# EAGLE schematic DP_eDP_Adapter (EAGLE 6.4)

## Sheet 1 of 3
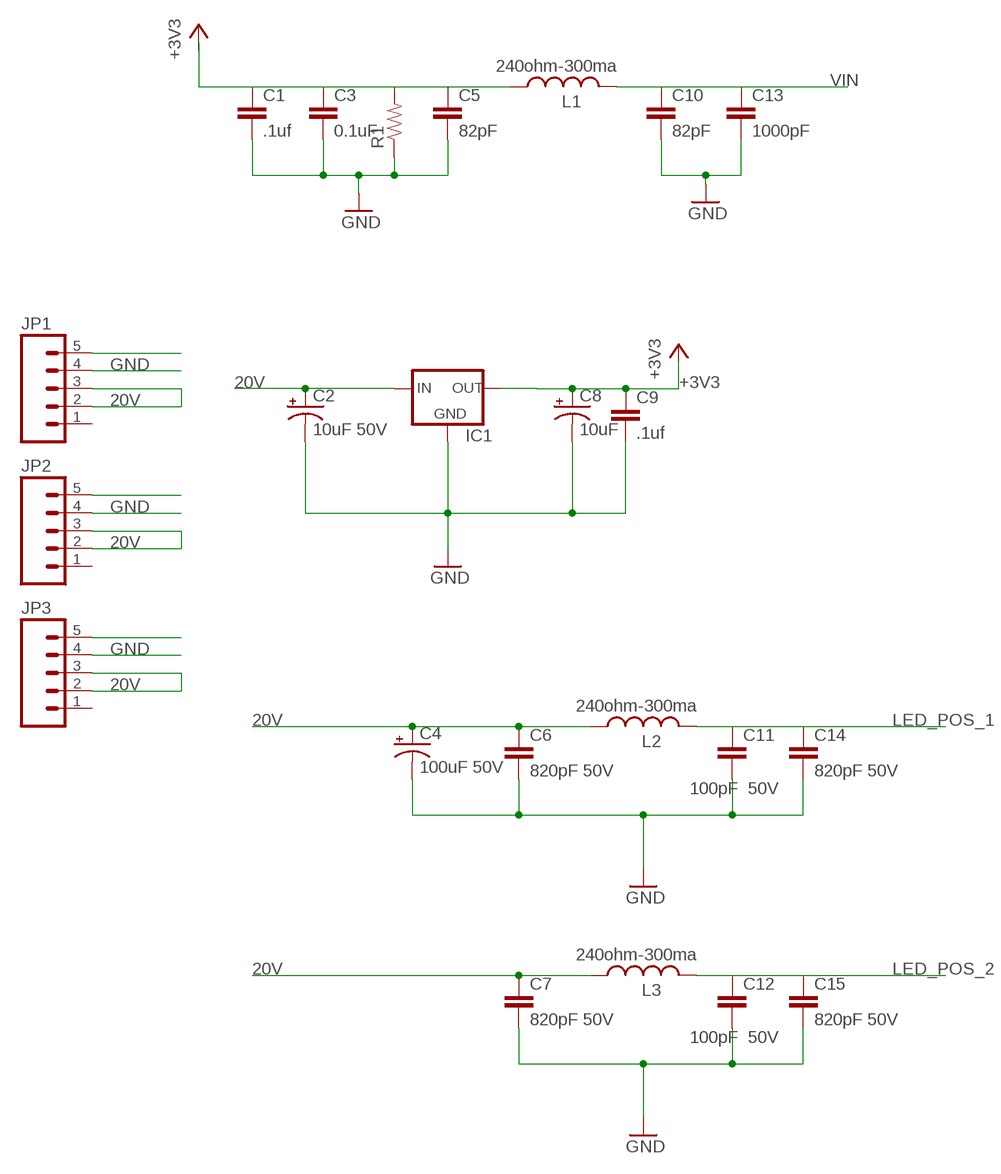
[diagram p0: schematic, sheet 1]

### Parts
C1  .1uf  CAP0402-CAP  [0402-CAP]
C2  10uF 50V  CAP_POL6032  [EIA6032]
C3  0.1uF  CAP0402-CAP  [0402-CAP]
C4  100uF 50V  CAP_POL6032  [EIA6032]
C5  82pF  CAP0402-CAP  [0402-CAP]
C6  820pF 50V  CAP0402-CAP  [0402-CAP]
C7  820pF 50V  CAP0402-CAP  [0402-CAP]
C8  10uF  CAP_POL6032  [EIA6032]
C9  .1uf  CAP0402-CAP  [0402-CAP]
C10  82pF  CAP0402-CAP  [0402-CAP]
C11  100pF 50V  CAP0402-CAP  [0402-CAP]
C12  100pF 50V  CAP0402-CAP  [0402-CAP]
C13  1000pF  CAP0402-CAP  [0402-CAP]
C14  820pF 50V  CAP0402-CAP  [0402-CAP]
C15  820pF 50V  CAP0402-CAP  [0402-CAP]
IC1  78XXS  [78XXS]
JP1  M05PTH  [1X05]
JP2  M05PTH  [1X05]
JP3  M05PTH  [1X05]
L1  240ohm-300ma  L-US  [R0402]
L2  240ohm-300ma  L-US  [R0402]
L3  240ohm-300ma  L-US  [R0402]
R1  RESISTOR0402-RES  [0402-RES]

### Nets
20V [Power]: C2.P$1(+) C4.P$1(+) C6.1 C7.1 IC1.IN JP1.2 JP1.3 JP2.2 JP2.3 JP3.2 JP3.3 L2.1 L3.1
+3V3: C1.1 C3.1 C5.1 C8.P$1(+) C9.1 IC1.OUT L1.1 R1.2 ; also sheet 2,3
GND: C1.2 C2.P$2(-) C3.2 C4.P$2(-) C5.2 C6.2 C7.2 C8.P$2(-) C9.2 C10.2 C11.2 C12.2 C13.2 C14.2 C15.2 IC1.GND JP1.4 JP1.5 JP2.4 JP2.5 JP3.4 JP3.5 R1.1 ; also sheet 2,3
LED_POS_1: C11.1 C14.1 L2.2 ; also sheet 3
LED_POS_2: C12.1 C15.1 L3.2 ; also sheet 3
VIN: C10.1 C13.1 L1.2 ; also sheet 3
Unconnected: JP1.1 JP2.1 JP3.1

## Sheet 2 of 3
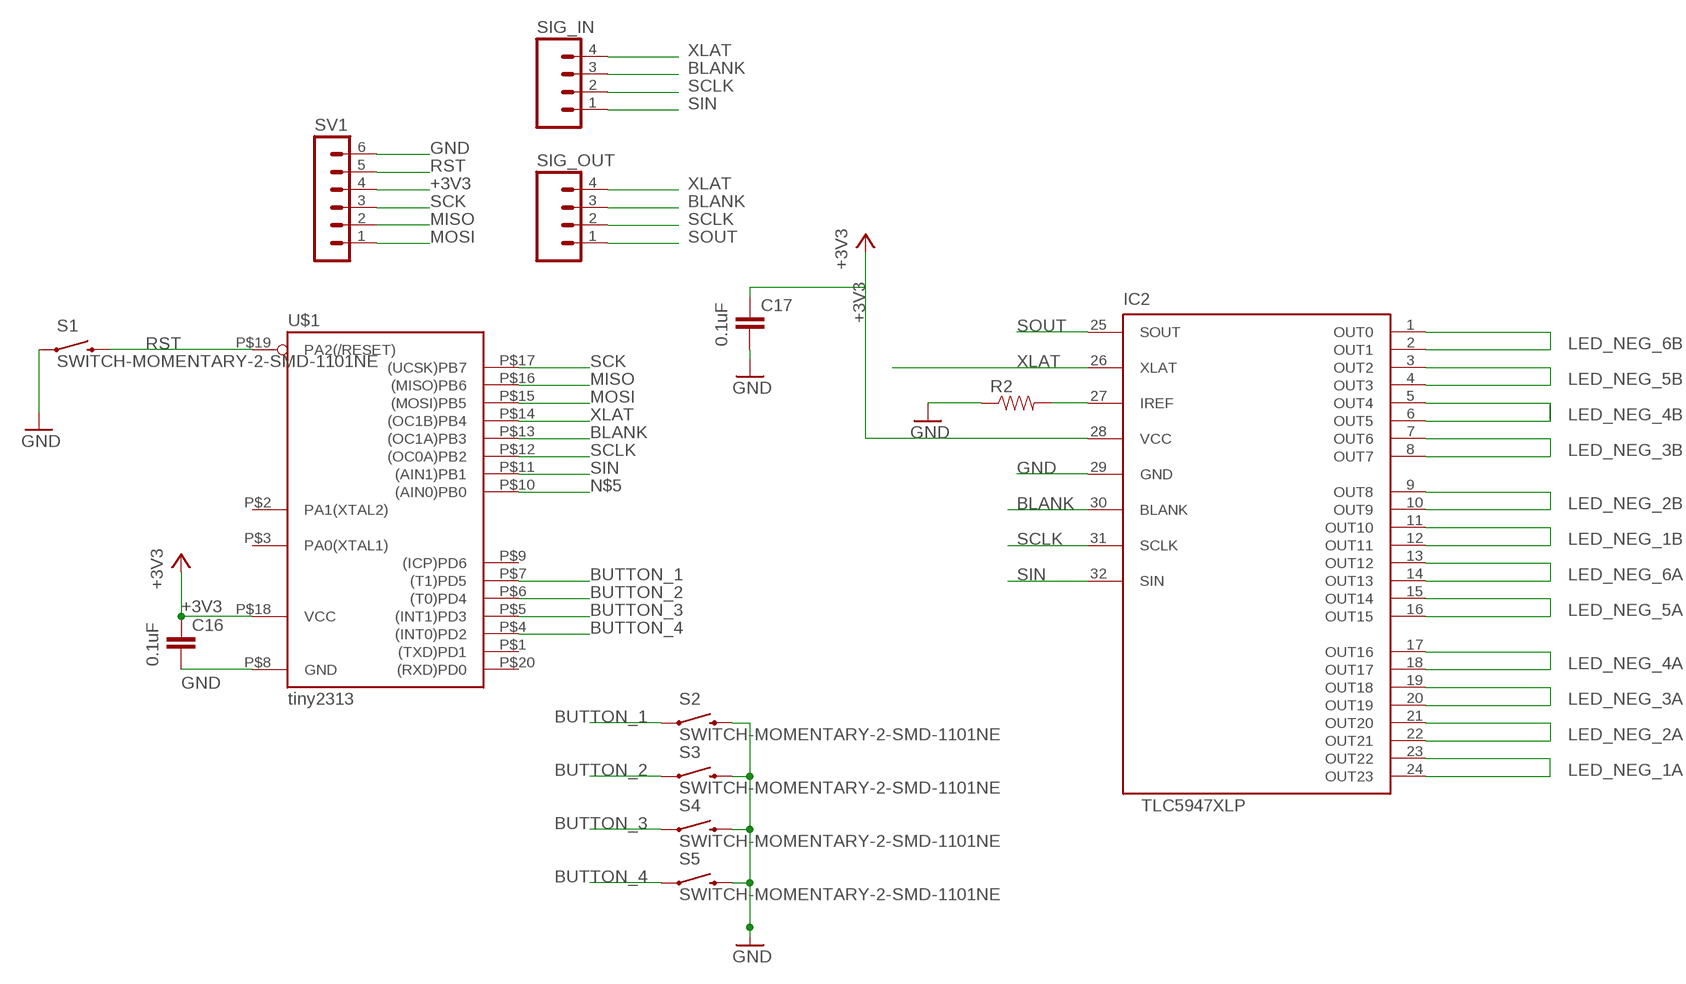
[diagram p1: schematic, sheet 2]

### Parts
C16  0.1uF  CAP0402-CAP  [0402-CAP]
C17  0.1uF  CAP0402-CAP  [0402-CAP]
IC2  TLC5947XLP  [QFN32_XLP]
R2  RESISTOR0402-RES  [0402-RES]
S1  SWITCH-MOMENTARY-2-SMD-1101NE  [TACTILE-SWITCH-1101NE]
S2  SWITCH-MOMENTARY-2-SMD-1101NE  [TACTILE-SWITCH-1101NE]
S3  SWITCH-MOMENTARY-2-SMD-1101NE  [TACTILE-SWITCH-1101NE]
S4  SWITCH-MOMENTARY-2-SMD-1101NE  [TACTILE-SWITCH-1101NE]
S5  SWITCH-MOMENTARY-2-SMD-1101NE  [TACTILE-SWITCH-1101NE]
SIG_IN  M04PTH  [1X04]
SIG_OUT  M04PTH  [1X04]
SV1  MA06-1  [MA06-1]
U$1  tiny2313  TINY2313-*M*  [MLF20]

### Nets
+3V3: C16.1 C17.1 IC2.28(VCC) SV1.4 U$1.P$18(VCC) ; also sheet 1,3
BLANK: IC2.30(BLANK) SIG_IN.3 SIG_OUT.3 U$1.P$13((OC1A)PB3)
BUTTON_1: S2.P$1 U$1.P$7((T1)PD5)
BUTTON_2: S3.P$1 U$1.P$6((T0)PD4)
BUTTON_3: S4.P$1 U$1.P$5((INT1)PD3)
BUTTON_4: S5.P$1 U$1.P$4((INT0)PD2)
GND: C16.2 C17.2 IC2.29(GND) R2.1 S1.P$1 S2.P$2 S3.P$2 S4.P$2 S5.P$2 SV1.6 U$1.P$8(GND) ; also sheet 1,3
LED_NEG_1A: IC2.23(OUT22) IC2.24(OUT23) ; also sheet 3
LED_NEG_1B: IC2.11(OUT10) IC2.12(OUT11) ; also sheet 3
LED_NEG_2A: IC2.21(OUT20) IC2.22(OUT21) ; also sheet 3
LED_NEG_2B: IC2.9(OUT8) IC2.10(OUT9) ; also sheet 3
LED_NEG_3A: IC2.19(OUT18) IC2.20(OUT19) ; also sheet 3
LED_NEG_3B: IC2.7(OUT6) IC2.8(OUT7) ; also sheet 3
LED_NEG_4A: IC2.17(OUT16) IC2.18(OUT17) ; also sheet 3
LED_NEG_4B: IC2.5(OUT4) IC2.6(OUT5) ; also sheet 3
LED_NEG_5A: IC2.15(OUT14) IC2.16(OUT15) ; also sheet 3
LED_NEG_5B: IC2.3(OUT2) IC2.4(OUT3) ; also sheet 3
LED_NEG_6A: IC2.13(OUT12) IC2.14(OUT13) ; also sheet 3
LED_NEG_6B: IC2.1(OUT0) IC2.2(OUT1) ; also sheet 3
MISO: SV1.2 U$1.P$16((MISO)PB6)
MOSI: SV1.1 U$1.P$15((MOSI)PB5)
N$5: U$1.P$10((AIN0)PB0)
N$13: IC2.27(IREF) R2.2
RST: S1.P$2 SV1.5 U$1.P$19(PA2(/RESET))
SCK: SV1.3 U$1.P$17((UCSK)PB7)
SCLK: IC2.31(SCLK) SIG_IN.2 SIG_OUT.2 U$1.P$12((OC0A)PB2)
SIN: IC2.32(SIN) SIG_IN.1 U$1.P$11((AIN1)PB1)
SOUT: IC2.25(SOUT) SIG_OUT.1
XLAT: IC2.26(XLAT) SIG_IN.4 SIG_OUT.4 U$1.P$14((OC1B)PB4)
Unconnected: U$1.P$1((TXD)PD1) U$1.P$2(PA1(XTAL2)) U$1.P$3(PA0(XTAL1)) U$1.P$9((ICP)PD6) U$1.P$20((RXD)PD0)

## Sheet 3 of 3
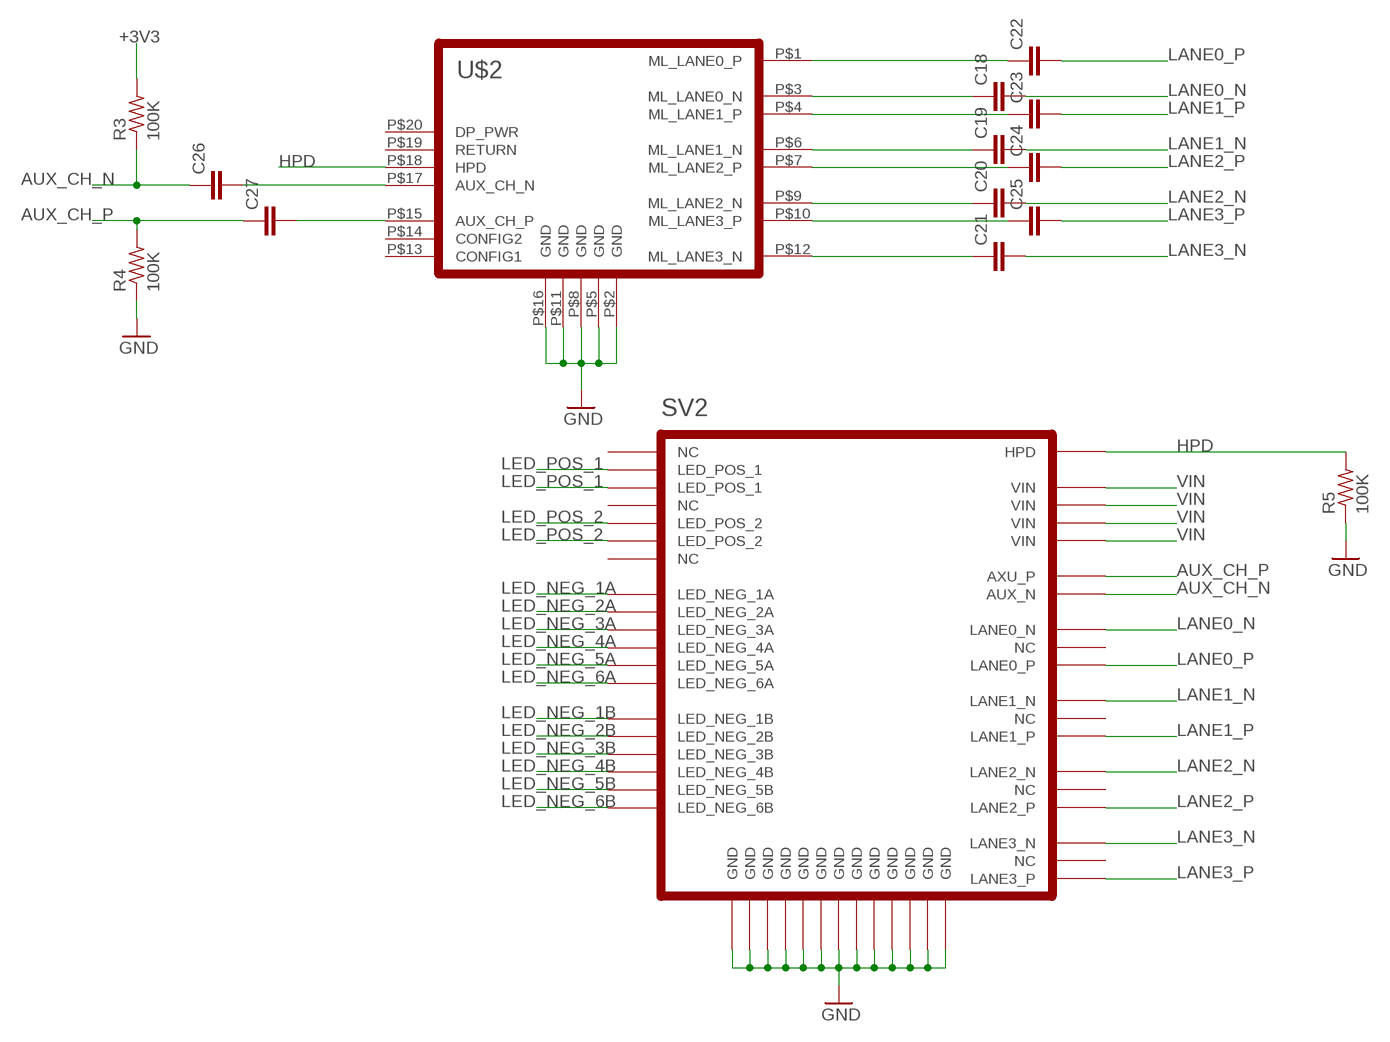
[diagram p2: schematic, sheet 3]

### Parts
C18  SPARKFUN-PASSIVES_CAP0402-CAP  [SPARKFUN-PASSIVES_0402-CAP]
C19  SPARKFUN-PASSIVES_CAP0402-CAP  [SPARKFUN-PASSIVES_0402-CAP]
C20  SPARKFUN-PASSIVES_CAP0402-CAP  [SPARKFUN-PASSIVES_0402-CAP]
C21  SPARKFUN-PASSIVES_CAP0402-CAP  [SPARKFUN-PASSIVES_0402-CAP]
C22  SPARKFUN-PASSIVES_CAP0402-CAP  [SPARKFUN-PASSIVES_0402-CAP]
C23  SPARKFUN-PASSIVES_CAP0402-CAP  [SPARKFUN-PASSIVES_0402-CAP]
C24  SPARKFUN-PASSIVES_CAP0402-CAP  [SPARKFUN-PASSIVES_0402-CAP]
C25  SPARKFUN-PASSIVES_CAP0402-CAP  [SPARKFUN-PASSIVES_0402-CAP]
C26  SPARKFUN-PASSIVES_CAP0402-CAP  [SPARKFUN-PASSIVES_0402-CAP]
C27  SPARKFUN-PASSIVES_CAP0402-CAP  [SPARKFUN-PASSIVES_0402-CAP]
R3  100K  R-US_R0402  [R0402]
R4  100K  R-US_R0402  [R0402]
R5  100K  R-US_R0402  [R0402]
SV2  EDP_CONNECTOR  [EDP_MOLEX]
U$2  DP1RD20JQ2R400  [DP_REVERSE_JAE]

### Nets
+3V3: R3.2 ; also sheet 1,2
AUX_CH_N: C26.1 R3.1 SV2.P$10(AUX_N)
AUX_CH_P: C27.1 R4.2 SV2.P$9(AXU_P)
AUX_N: C26.2 U$2.P$17(AUX_CH_N)
AUX_P: C27.2 U$2.P$15(AUX_CH_P)
GND: R4.1 R5.1 SV2.P$1(GND) SV2.P$3(GND) SV2.P$8(GND) SV2.P$11(GND) SV2.P$15(GND) SV2.P$19(GND) SV2.P$23(GND) SV2.P$27(GND) SV2.P$28(GND) SV2.P$29(GND) SV2.P$36(GND) SV2.P$43(GND) SV2.P$51(GND) U$2.P$2(GND) U$2.P$5(GND) U$2.P$8(GND) U$2.P$11(GND) U$2.P$16(GND) ; also sheet 1,2
HPD: R5.2 SV2.P$2(HPD) U$2.P$18(HPD)
LANE0_N: C18.2 SV2.P$12(LANE0_N)
LANE0_P: C22.2 SV2.P$14(LANE0_P)
LANE1_N: C19.2 SV2.P$16(LANE1_N)
LANE1_P: C23.2 SV2.P$18(LANE1_P)
LANE2_N: C20.2 SV2.P$20(LANE2_N)
LANE2_P: C24.2 SV2.P$22(LANE2_P)
LANE3_N [DP]: C21.2 SV2.P$24(LANE3_N)
LANE3_P [DP]: C25.2 SV2.P$26(LANE3_P)
LED_NEG_1A: SV2.P$42(LED_NEG_1A) ; also sheet 2
LED_NEG_1B: SV2.P$35(LED_NEG_1B) ; also sheet 2
LED_NEG_2A: SV2.P$41(LED_NEG_2A) ; also sheet 2
LED_NEG_2B: SV2.P$34(LED_NEG_2B) ; also sheet 2
LED_NEG_3A: SV2.P$40(LED_NEG_3A) ; also sheet 2
LED_NEG_3B: SV2.P$33(LED_NEG_3B) ; also sheet 2
LED_NEG_4A: SV2.P$39(LED_NEG_4A) ; also sheet 2
LED_NEG_4B: SV2.P$32(LED_NEG_4B) ; also sheet 2
LED_NEG_5A: SV2.P$38(LED_NEG_5A) ; also sheet 2
LED_NEG_5B: SV2.P$31(LED_NEG_5B) ; also sheet 2
LED_NEG_6A: SV2.P$37(LED_NEG_6A) ; also sheet 2
LED_NEG_6B: SV2.P$30(LED_NEG_6B) ; also sheet 2
LED_POS_1: SV2.P$48(LED_POS_1) SV2.P$49(LED_POS_1) ; also sheet 1
LED_POS_2: SV2.P$45(LED_POS_2) SV2.P$46(LED_POS_2) ; also sheet 1
N$3_N [DP]: C18.1 U$2.P$3(ML_LANE0_N)
N$3_P [DP]: C22.1 U$2.P$1(ML_LANE0_P)
N$15_N [DP]: C19.1 U$2.P$6(ML_LANE1_N)
N$15_P [DP]: C23.1 U$2.P$4(ML_LANE1_P)
N$17_N [DP]: C20.1 U$2.P$9(ML_LANE2_N)
N$17_P [DP]: C24.1 U$2.P$7(ML_LANE2_P)
N$19_N [DP]: C21.1 U$2.P$12(ML_LANE3_N)
N$19_P [DP]: C25.1 U$2.P$10(ML_LANE3_P)
VIN: SV2.P$4(VIN) SV2.P$5(VIN) SV2.P$6(VIN) SV2.P$7(VIN) ; also sheet 1
Unconnected: SV2.P$13(NC) SV2.P$17(NC) SV2.P$21(NC) SV2.P$25(NC) SV2.P$44(NC) SV2.P$47(NC) SV2.P$50(NC) U$2.P$13(CONFIG1) U$2.P$14(CONFIG2) U$2.P$19(RETURN) U$2.P$20(DP_PWR)

## Library data of the parts
C1 C3 C5-C7 C9-C15 = SparkFun-Passives:CAP: Capacitor Standard 0603 ceramic capacitor, and 0.1" leaded capacitor.
C2 C4 C8 = SparkFun-Passives:CAP_POL: Capacitor Polarized These are standard SMD and PTH capacitors. Normally 10uF, 47uF, and 100uF in electrolytic and tantalum varieties. Always verify the external diameter of the through hole cap, it varies with capacity, voltage, and manufacturer. The EIA devices should be standard.
C16 C17 = SparkFun:CAP: Capacitor Standard 0603 ceramic capacitor, and 0.1" leaded capacitor.
C18-C27 = DP_eDP_Adapter:SPARKFUN-PASSIVES_CAP: Capacitor Standard 0603 ceramic capacitor, and 0.1" leaded capacitor.
IC1 = v-reg:78XXS: VOLTAGE REGULATOR
IC2 = slice_noshift:TLC5947
JP1-JP3 = SparkFun-Connectors:M05: Header 5 Standard 5-pin 0.1" header. Use with straight break away headers (SKU : PRT-00116), right angle break away headers (PRT-00553), swiss pins (PRT-00743), machine pins (PRT-00117), and female headers (PRT-00115). Molex polarized connector foot print use with SKU : PRT-08230 with associated crimp pins and housings.
L1-L3 = rcl:L-US: INDUCTOR, American symbol
R1 R2 = SparkFun-Passives:RESISTOR: Resistor Basic schematic elements and footprints for 0603, 1206, and PTH resistors.
R3-R5 = rcl:R-US_: RESISTOR, American symbol
S1-S5 = SparkFun-Electromechanical:SWITCH-MOMENTARY-2: Various NO switches- pushbuttons, reed, etc
SIG_IN SIG_OUT = SparkFun-Connectors:M04: Header 4 Standard 4-pin 0.1" header. Use with straight break away headers (SKU : PRT-00116), right angle break away headers (PRT-00553), swiss pins (PRT-00743), machine pins (PRT-00117), and female headers (PRT-00115). Molex polarized connector foot print use with SKU : PRT-08231 with associated crimp pins and housings. 1MM SMD Version SKU: PRT-10208
SV1 = NSL:MA06-1: PIN HEADER
SV2 = DP_eDP_Adapter:EDP_CONNECTOR
U$1 = NSL_Cylon:TINY2313*: Atmel Tiny2313 2K Flash, 128 bytes EEPROM, 128 bytes RAM
U$2 = DP_eDP_Adapter:DP1RD20JQ2R400

## Net classes
0 default: width 0.203 mm
1 DP: width 0.203 mm, drill 0.305 mm, clearance 0.203 mm
2 Power: width 0.305 mm